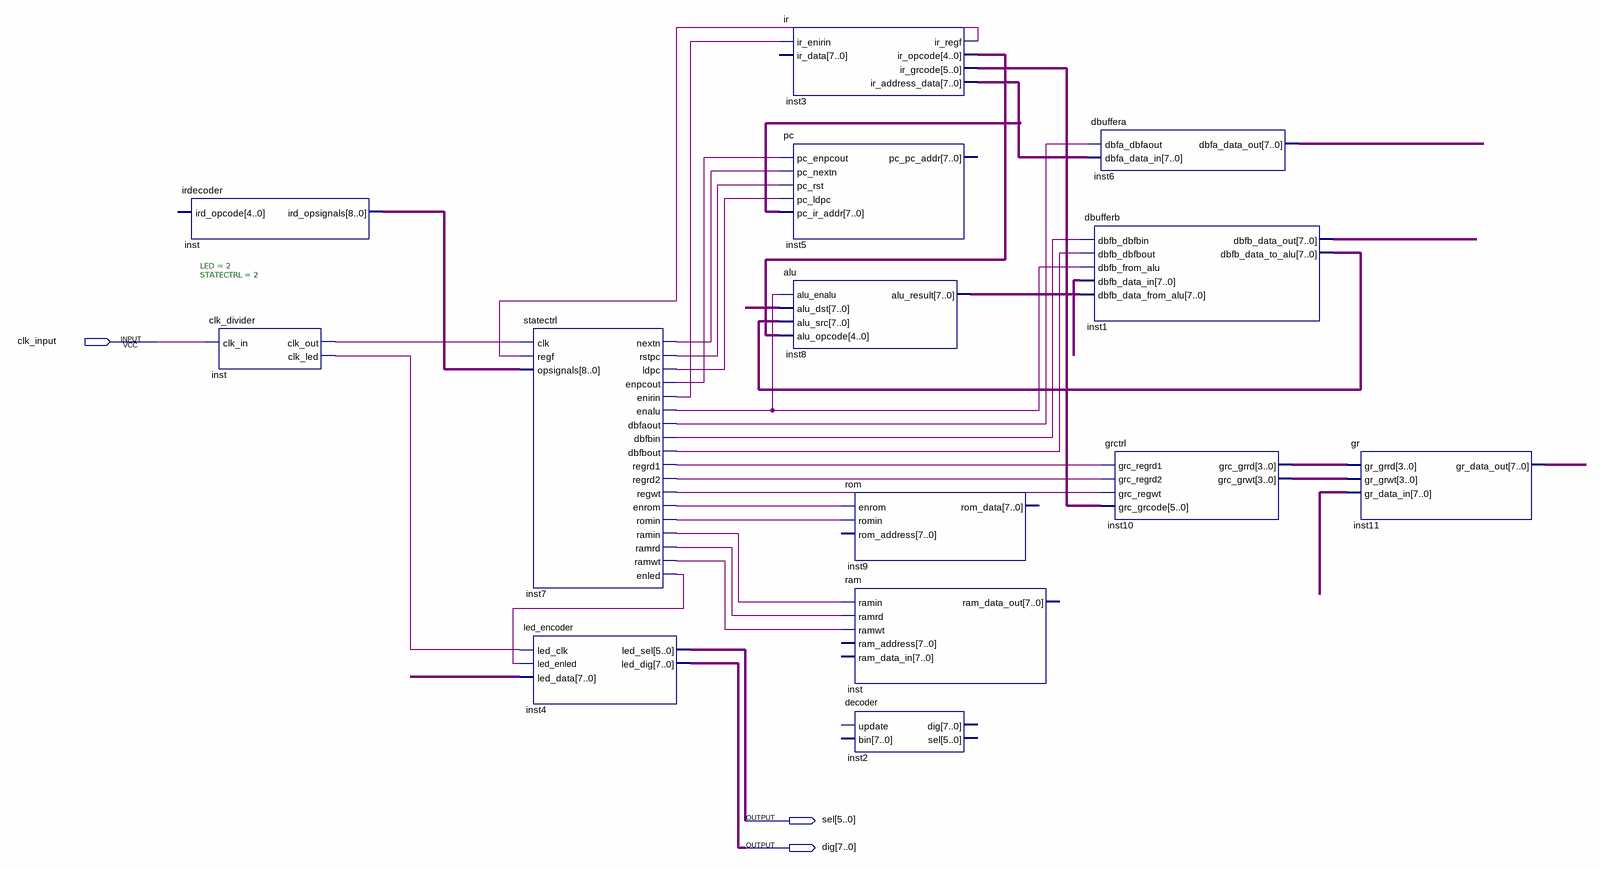
[diagram p0: schematic sheet]
// Quartus schematic 2073_II.bdf as structural Verilog: 14 symbols, 3 pins
module \2073_II  (
  input  clk_input,
  output [5:0] sel,
  output [7:0] dig
);

  wire inst3_ir_regf, inst7_dbfaout, inst7_dbfbin, inst7_dbfbout, inst7_enalu, inst7_enirin, inst7_enled,
       inst7_enpcout, inst7_enrom, inst7_ldpc, inst7_nextn, inst7_ramin, inst7_ramrd, inst7_ramwt,
       inst7_regrd1, inst7_regrd2, inst7_regwt, inst7_romin, inst7_rstpc, inst_clk_led, inst_clk_out;
  wire [3:0] inst10_grc_grrd, inst10_grc_grwt;
  wire [4:0] inst3_ir_opcode;
  wire [5:0] inst3_ir_grcode;
  wire [7:0] inst1_dbfb_data_out, inst1_dbfb_data_to_alu, inst3_ir_address_data, inst6_dbfa_data_out,
       inst8_alu_result, inst11_gr_data_out, undriven, undriven_2, undriven_3, undriven_4;
  wire [8:0] inst_ird_opsignals;

  irdecoder inst (.ird_opsignals(inst_ird_opsignals));  // open: ird_opcode
  clk_divider #(.LED(2), .STATECTRL(2)) inst_dup2 (.clk_in(clk_input), .clk_out(inst_clk_out), .clk_led(inst_clk_led));
  statectrl inst7 (
    .clk(inst_clk_out), .regf(inst3_ir_regf), .opsignals(inst_ird_opsignals), .nextn(inst7_nextn),
    .rstpc(inst7_rstpc), .ldpc(inst7_ldpc), .enpcout(inst7_enpcout), .enirin(inst7_enirin),
    .enalu(inst7_enalu), .dbfaout(inst7_dbfaout), .dbfbin(inst7_dbfbin), .dbfbout(inst7_dbfbout),
    .regrd1(inst7_regrd1), .regrd2(inst7_regrd2), .regwt(inst7_regwt), .enrom(inst7_enrom),
    .romin(inst7_romin), .ramin(inst7_ramin), .ramrd(inst7_ramrd), .ramwt(inst7_ramwt), .enled(inst7_enled));
  led_encoder inst4 (
    .led_clk(inst_clk_led), .led_enled(inst7_enled), .led_data(undriven), .led_sel(sel), .led_dig(dig));
  ir inst3 (
    .ir_enirin(inst7_enirin), .ir_regf(inst3_ir_regf), .ir_opcode(inst3_ir_opcode),
    .ir_grcode(inst3_ir_grcode), .ir_address_data(inst3_ir_address_data));  // open: ir_data
  pc inst5 (
    .pc_enpcout(inst7_enpcout), .pc_nextn(inst7_nextn), .pc_rst(inst7_rstpc), .pc_ldpc(inst7_ldpc),
    .pc_ir_addr(inst3_ir_address_data));  // open: pc_pc_addr
  alu inst8 (
    .alu_enalu(inst7_enalu), .alu_dst(undriven_3), .alu_src(inst1_dbfb_data_to_alu),
    .alu_opcode(inst3_ir_opcode), .alu_result(inst8_alu_result));
  rom inst9 (.enrom(inst7_enrom), .romin(inst7_romin));  // open: rom_address, rom_data
  ram inst_dup3 (
    .ramin(inst7_ramin), .ramrd(inst7_ramrd), .ramwt(inst7_ramwt));  // open: ram_address, ram_data_in, ram_data_out
  decoder inst2 ();  // open: update, bin, dig, sel
  dbuffera inst6 (
    .dbfa_dbfaout(inst7_dbfaout), .dbfa_data_in(inst3_ir_address_data), .dbfa_data_out(inst6_dbfa_data_out));
  dbufferb inst1 (
    .dbfb_dbfbin(inst7_dbfbin), .dbfb_dbfbout(inst7_dbfbout), .dbfb_from_alu(inst7_enalu),
    .dbfb_data_in(undriven_4), .dbfb_data_from_alu(inst8_alu_result), .dbfb_data_out(inst1_dbfb_data_out),
    .dbfb_data_to_alu(inst1_dbfb_data_to_alu));
  grctrl inst10 (
    .grc_regrd1(inst7_regrd1), .grc_regrd2(inst7_regrd2), .grc_regwt(inst7_regwt),
    .grc_grcode(inst3_ir_grcode), .grc_grrd(inst10_grc_grrd), .grc_grwt(inst10_grc_grwt));
  gr inst11 (
    .gr_grrd(inst10_grc_grrd), .gr_grwt(inst10_grc_grwt), .gr_data_in(undriven_2),
    .gr_data_out(inst11_gr_data_out));
endmodule
